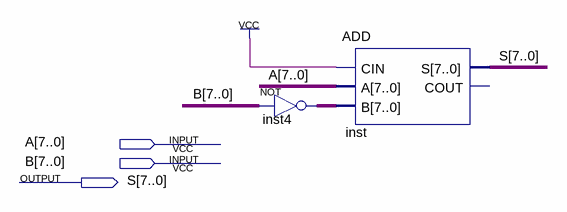
[diagram p0: schematic sheet]
// Quartus schematic SUB8bit.bdf as structural Verilog: 2 symbols, 3 pins
module SUB8bit (
  input  [7:0] A,
  input  [7:0] B,
  output [7:0] S
);

  wire [7:0] inst4_out;

  assign inst4_out = ~B;  // NOT inst4, 8 bits wide
  ADD inst (.CIN(1'b1), .A(A), .B(inst4_out), .S(S));  // open: COUT
endmodule
